# EasyEDA Pro project Radio Robotic GloveBox Manipulator.eprj

# Schematic Radio Robotic GloveBox Manipulator
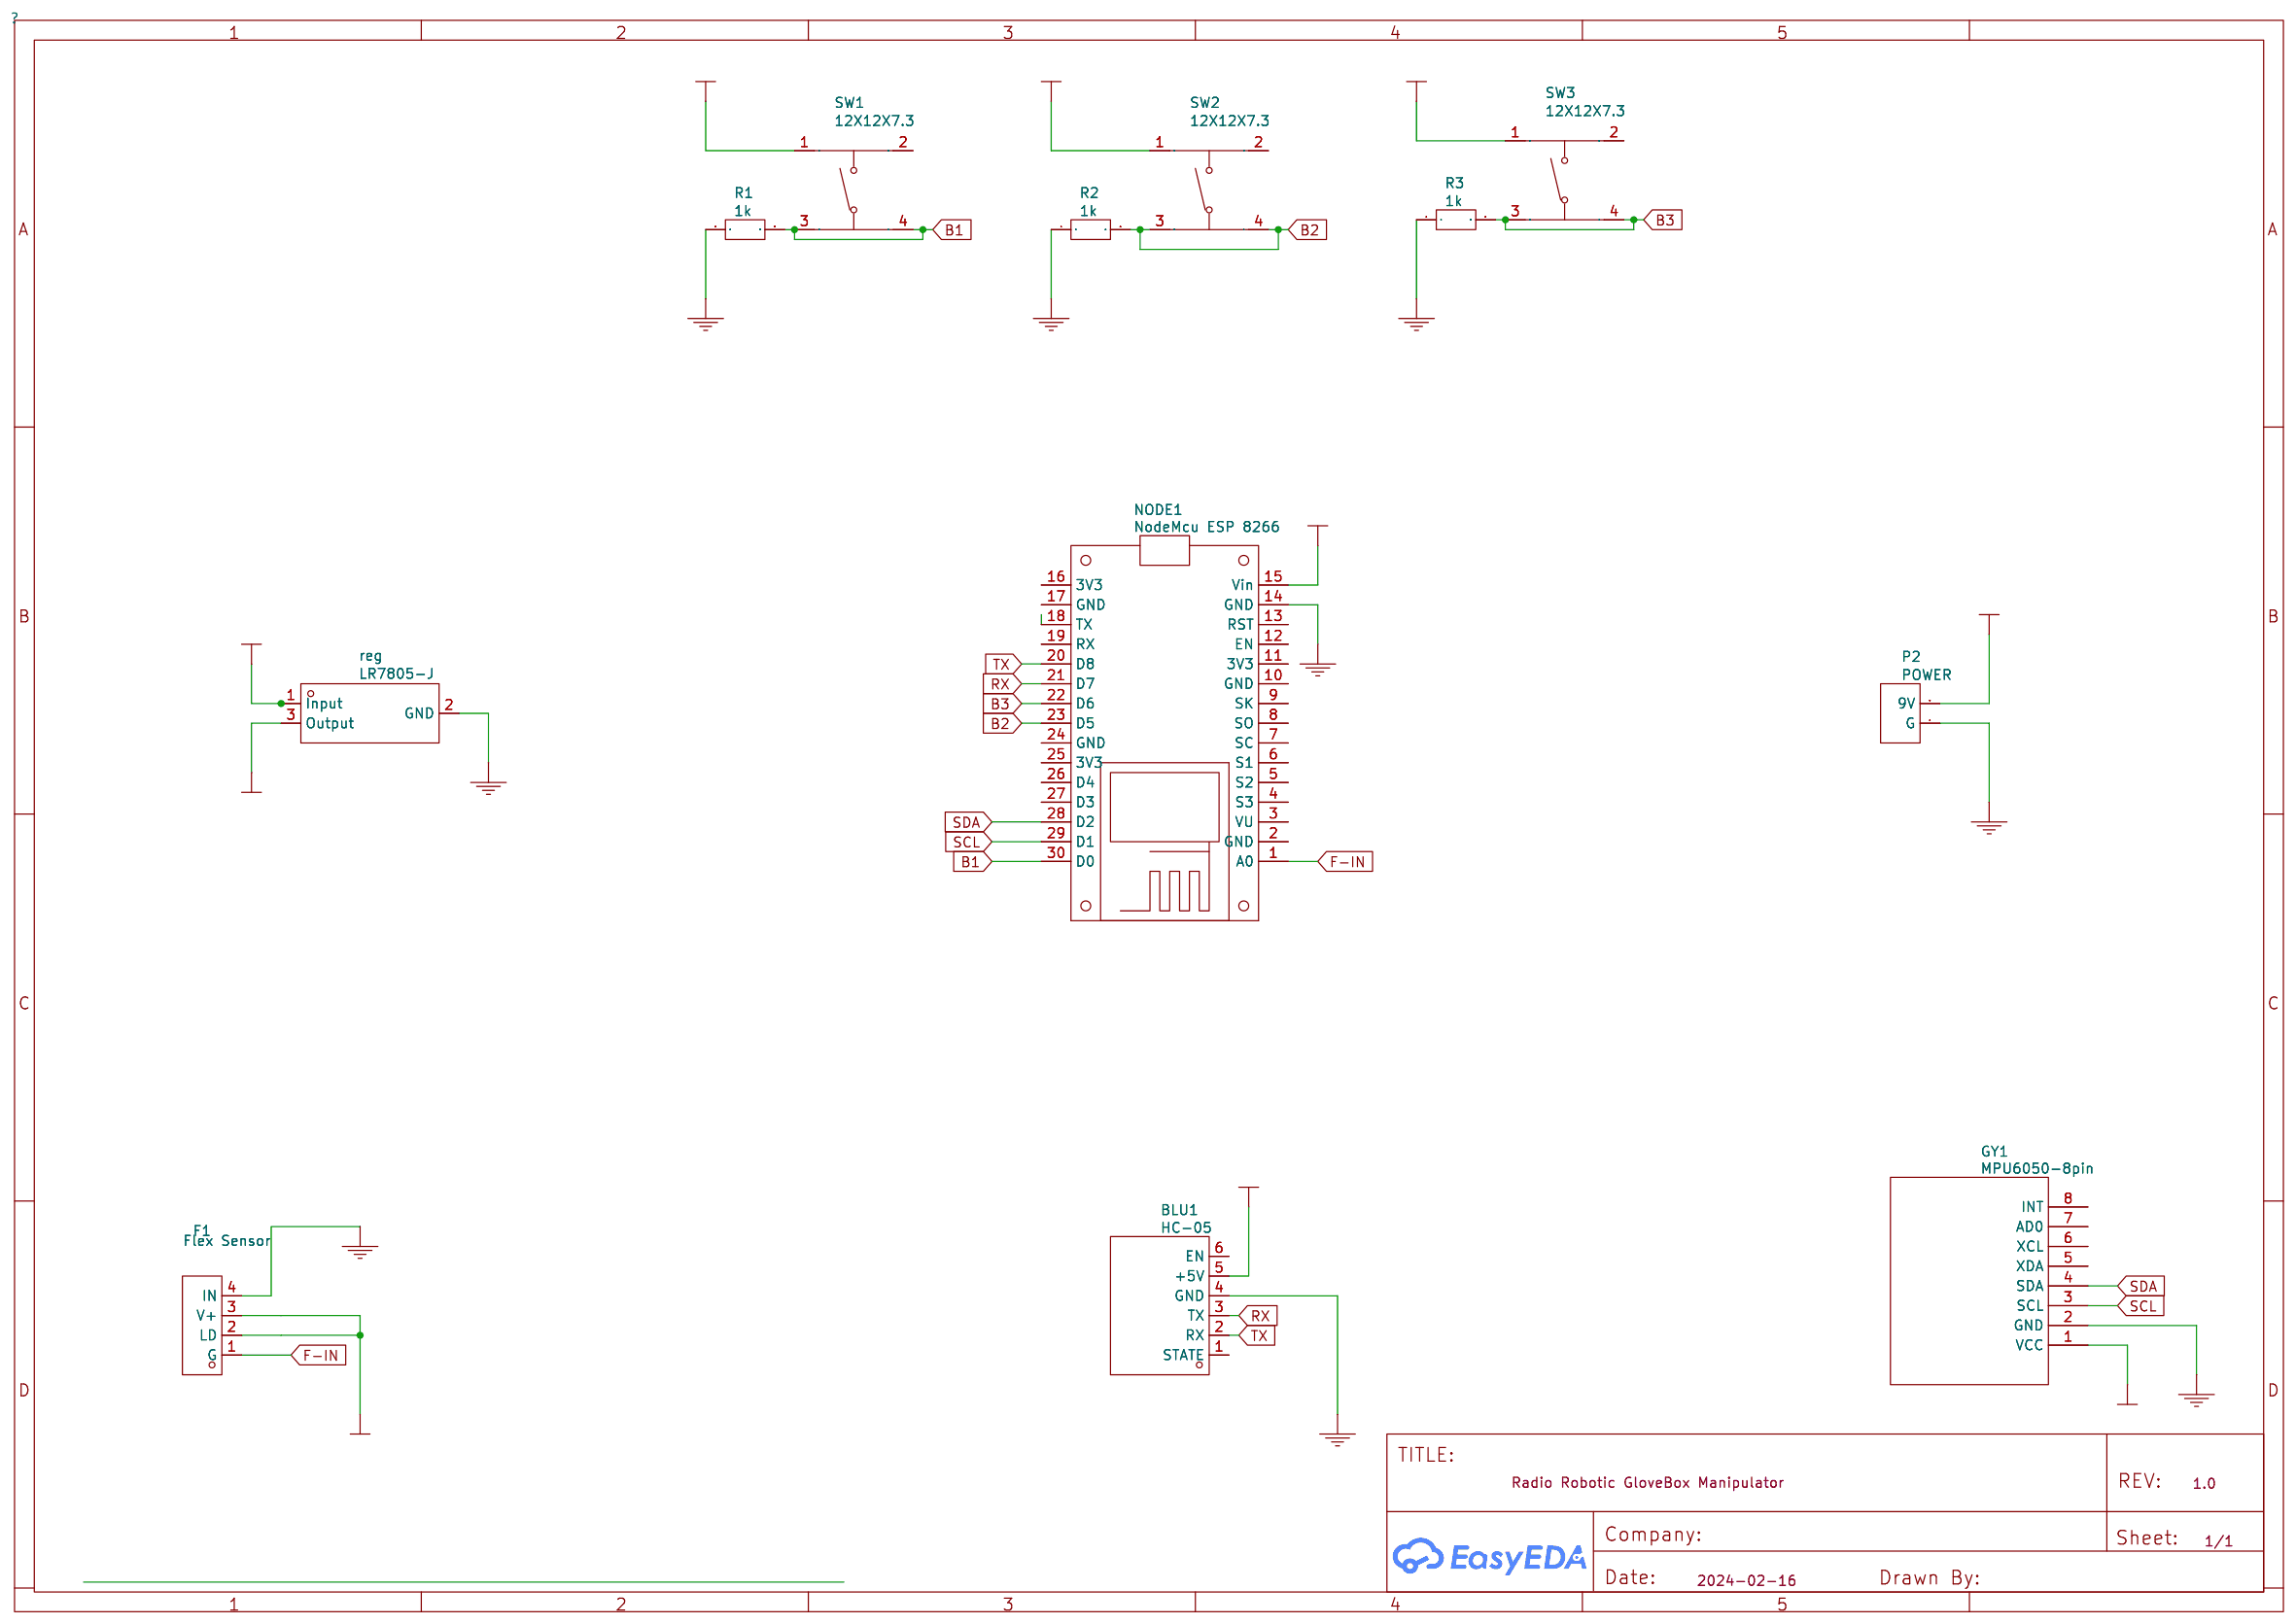
[diagram p0: schematic sheet]

## Parts
BLU1  HC-05  [HC-05]
F1  Flex Sensor  [CONN-TH_8P-P2.00_KINGHELM_KH-2FH-1X8P-H4.3]
GY1  MPU6050-8pin  [MPU6050-8PIN]
NODE1  NodeMcu ESP 8266  [NODEMCU-12E;NODEMCU-ESP8266]
P2  POWER  [CONN-TH_2P-P5.00]
R1  1k  [R_AXIAL-0.4]
R2  1k  [R_AXIAL-0.4]
R3  1k  [R_AXIAL-0.4]
reg  LR7805-J  [TO-220_L10.2-W4.6-P2.54_LR7805]
SW1  12X12X7.3  [SW-TH_4P-L12.0-W12.0-P5.00-LS12.5]
SW2  12X12X7.3  [SW-TH_4P-L12.0-W12.0-P5.00-LS12.5]
SW3  12X12X7.3  [SW-TH_4P-L12.0-W12.0-P5.00-LS12.5]

## Library data of the parts
BLU1 = HC-05
F1 = Flex Sensor: Supplier: LCSC; Supplier Part: C2938433; Manufacturer: kinghelm(金航标); Manufacturer Part: KH-2FH-1X8P-H4.3; JLCPCB Part Class: Extended Part
GY1 = MPU6050-8pin
NODE1 = NodeMcu ESP 8266: Supplier: TME
P2 = POWER: Supplier: LCSC
R1-R3 = 1k
reg = LR7805-J: Supplier: LCSC; Supplier Part: C6398168; Manufacturer: LR(朗瑞)
SW1-SW3 = 12X12X7.3: Supplier: LCSC; Supplier Part: C10861; Manufacturer: BOOMELE(博穆精密); Manufacturer Part: 12x12x7.3 黄头; JLCPCB Part Class: Extended Part

## Nets
+5V: BLU1.5(+5V) F1.2(LD) F1.3(V+) GY1.1(VCC) NODE1.15(Vin) reg.3(Output) SW1.1 SW2.1 SW3.1
GND: BLU1.4(GND) F1.4(IN) GY1.2(GND) NODE1.14(GND) P2.1(G) R1.1 R2.1 R3.1 reg.2(GND)
VCC: P2.2(9V) reg.1(Input)
B1: NODE1.30(D0) R1.2 SW1.3 SW1.4
B2: NODE1.23(D5) R2.2 SW2.3 SW2.4
B3: NODE1.22(D6) R3.2 SW3.3 SW3.4
F-IN: F1.1(G) NODE1.1(A0)
RX: BLU1.3(TX) NODE1.21(D7)
SCL: GY1.3(SCL) NODE1.29(D1)
SDA: GY1.4(SDA) NODE1.28(D2)
TX: BLU1.2(RX) NODE1.20(D8)

Not connected (* = marked no-connect by the designer): BLU1 1(STATE) 6(EN); GY1 5(XDA) 6(XCL) 7(AD0) 8(INT); NODE1 2(GND) 3(VU) 4(S3) 5(S2) 6(S1) 7(SC) 8(SO) 9(SK) 10(GND) 11(3V3) 12(EN) 13(RST) 16(3V3) 17(GND) 18(TX) 19(RX) 24(GND) 25(3V3) 26(D4) 27(D3); SW1 2; SW2 2; SW3 2

# Board MASTER
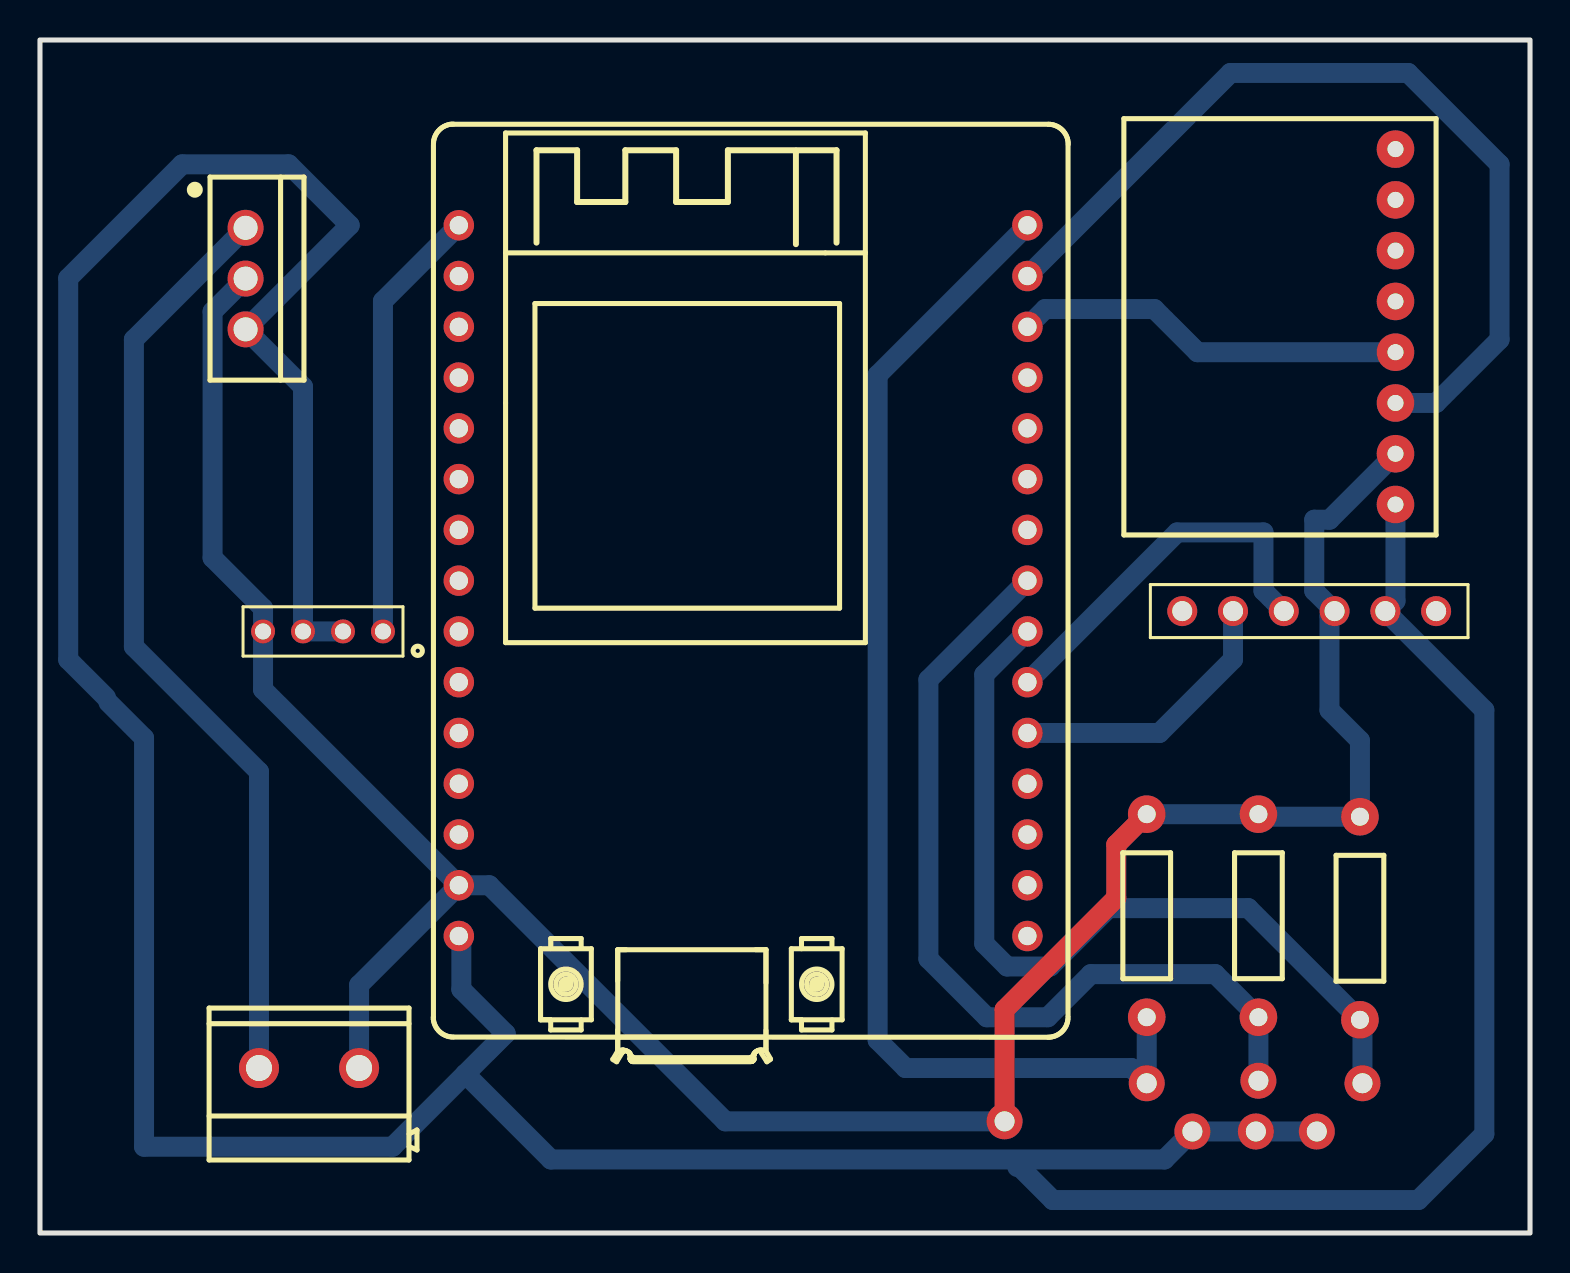
[diagram p1: board, top side]
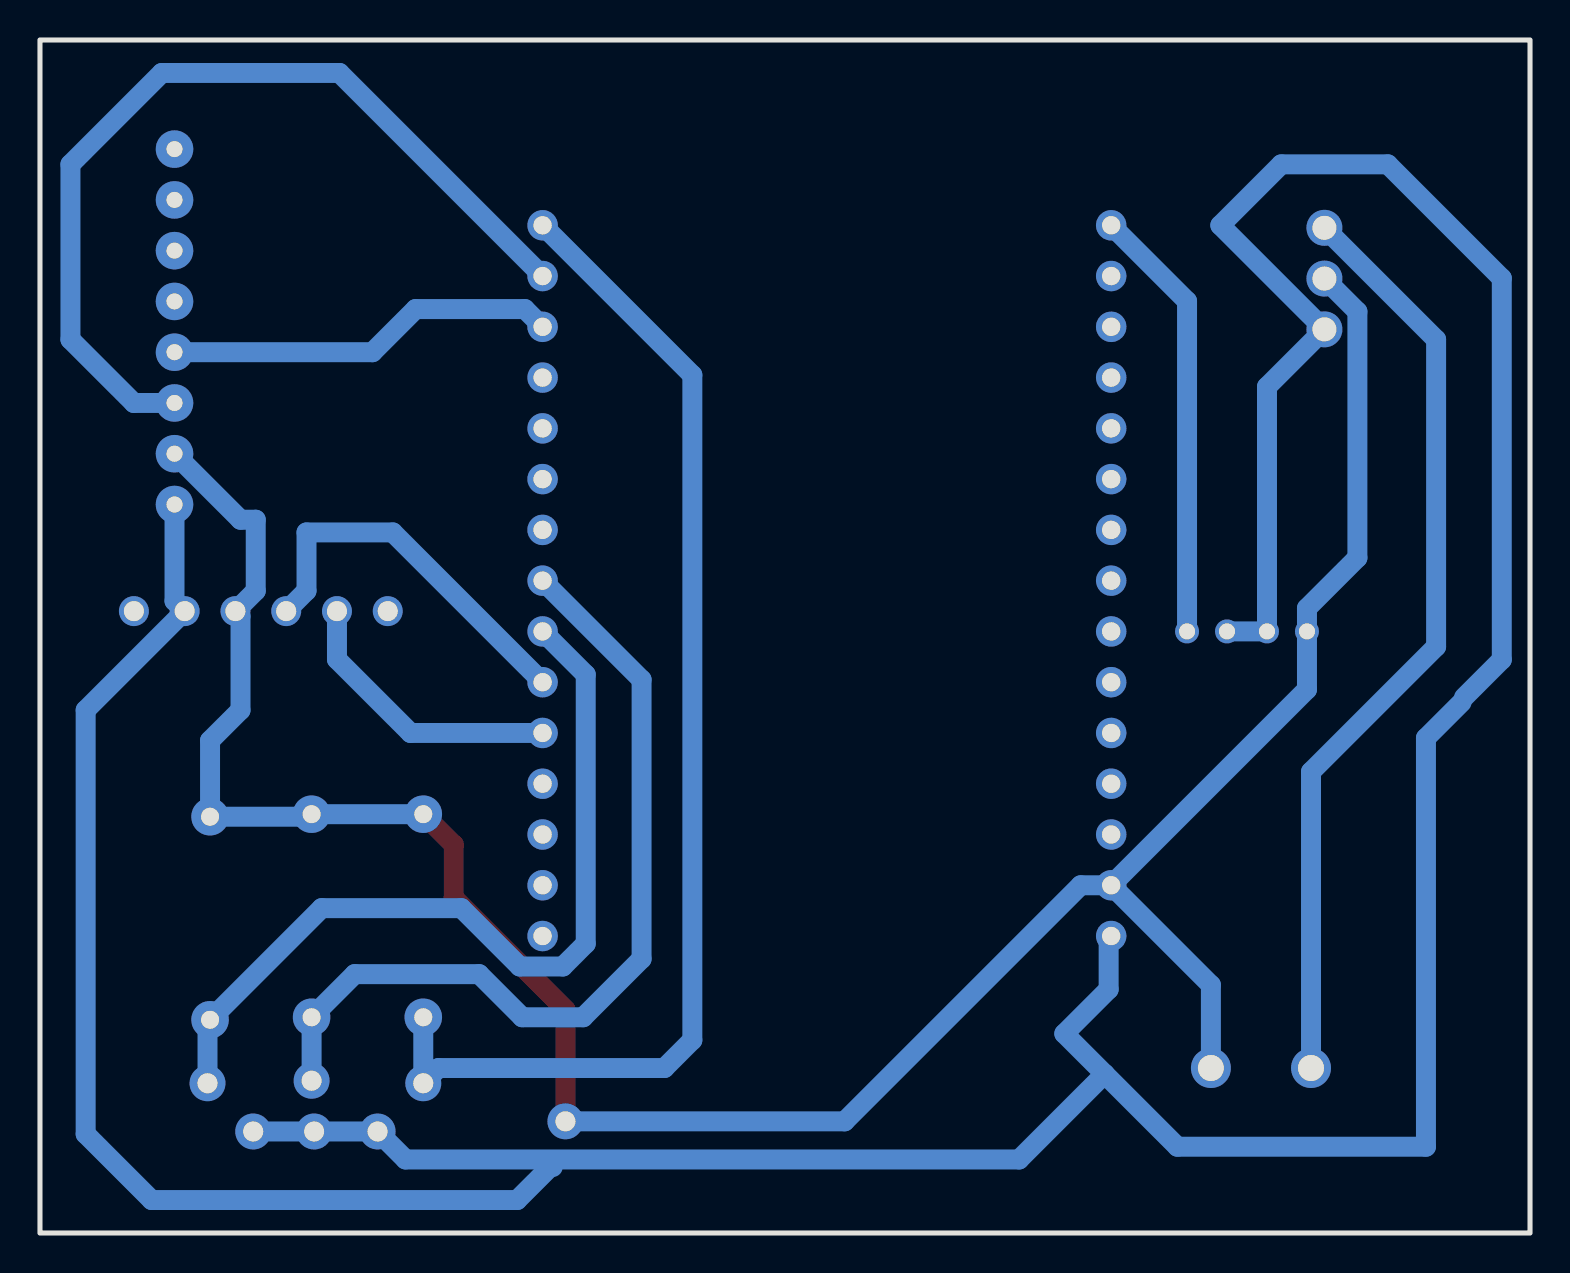
[diagram p2: board, bottom side, seen from below]

Outline 74.55 x 59.69 mm; copper layers: Top Layer, Bottom Layer. Coordinates in mm from the lower left corner of the outline.
Outline path: rectangle 0,59.69 74.55,0
Stack: Top Layer 0.035mm / Dielectric1 1.51mm FR4 er 4.5 / Bottom Layer 0.035mm

## Design rules (mm)
template: Custom Config
spacing copperThickness1oz (default): track to track 0.4, other pairs 0.152 to 0.5
spacing copperThickness2oz: track to track 0.203, other pairs 0.152 to 0.3
track width copperThickness1oz (default): min 0.8, default 1, max 2
track width copperThickness2oz: min 0.203, default 0.254, max 2.54
differential pair differentialPair (default): width min 0.127, default 0.254, max 2.54; gap min 0.152, default 0.152
via viaSize (default): diameter min 0.5, default 0.61, max 10; hole min 0.3, default 0.305, max 6.3

## Placement (name value [footprint] x y rotation side)
BLU1  -  [HC-05]  63.5 31.11 180 top
F1  Flex Sensor  [CONN-TH_8P-P2.00_KINGHELM_KH-2FH-1X8P-H4.3]  10.16 30.1 180 top
GY1  MPU6050-8pin  [MPU6050-8PIN]  69.85 34.92 90 top
NODE1  NodeMcu ESP 8266  [NODEMCU-12E;NODEMCU-ESP8266]  32.38 37.72 0 top
NOREF  -  [Pad_e7353]  48.26 5.59 0 top
NOREF#2  -  [Pad_e7187]  60.96 7.62 0 top
NOREF#3  -  [Pad_e7258]  57.66 5.08 0 top
NOREF#4  -  [Pad_e7260]  63.88 5.08 0 top
NOREF#5  -  [Pad_e7188]  66.17 7.49 0 top
NOREF#6  -  [Pad_e7259]  60.83 5.08 0 top
NOREF#7  -  [Pad_e7186]  55.37 7.49 0 top
P2  POWER  [CONN-TH_2P-P5.00]  13.46 8.25 180 top
R1  1k  [R_AXIAL-0.4]  55.37 15.88 270 top
R2  1k  [R_AXIAL-0.4]  60.96 15.88 270 top
R3  1k  [R_AXIAL-0.4]  66.04 15.75 270 top
reg  LR7805-J  [TO-220_L10.2-W4.6-P2.54_LR7805]  10.29 47.75 270 top

## Footprints (pads in the part's own frame, mm; a bottom-side part is the same pattern mirrored in y, then rotated)
CONN-TH_2P-P5.00
  round 2 hole 1.3: 1(-2.505,0) 2(2.505,0)
CONN-TH_8P-P2.00_KINGHELM_KH-2FH-1X8P-H4.3
  round 1.2 hole 0.8: 1(-7,0) 2(-5,0) 3(-3,0) 4(-1,0)
HC-05
  round 1.5 hole 1: 1(6.35,0) 2(3.81,0) 3(1.27,0) 4(-1.27,0) 5(-3.81,0) 6(-6.35,0)
MPU6050-8PIN
  round 1.879 hole 0.8: 1(1.524,2.032) 2(4.064,2.032) 3(6.604,2.032) 4(9.144,2.032) 5(11.684,2.032) 6(14.224,2.032) 7(16.764,2.032) 8(19.304,2.032)
NODEMCU-12E;NODEMCU-ESP8266
  round 1.524 hole 0.914: 1(-11.43,12.7) 2(-11.43,10.16) 3(-11.43,7.62) 4(-11.43,5.08) 5(-11.43,2.54) 6(-11.43,0) 7(-11.43,-2.54) 8(-11.43,-5.08) 9(-11.43,-7.62) 10(-11.43,-10.16) 11(-11.43,-12.7) 12(-11.43,-15.24) 13(-11.43,-17.78) 14(-11.43,-20.32) 15(-11.43,-22.86) 16(17.018,-22.86) 17(17.018,-20.32) 18(17.018,-17.78) 19(17.018,-15.24) 20(17.018,-12.7) 21(17.018,-10.16) 22(17.018,-7.62) 23(17.018,-5.08) 24(17.018,-2.54) 25(17.018,0) 26(17.018,2.54) 27(17.018,5.08) 28(17.018,7.62) 29(17.018,10.16) 30(17.018,12.7)
Pad_e7186
  round 1.8 hole 1: 1(0,0)
Pad_e7187
  round 1.8 hole 1: 2(0,0)
Pad_e7188
  round 1.8 hole 1: 3(0,0)
Pad_e7258
  round 1.8 hole 1: 4(0,0)
Pad_e7259
  round 1.8 hole 1: 31(0,0)
Pad_e7260
  round 1.8 hole 1: 32(0,0)
Pad_e7353
  round 1.8 hole 1: 33(0,0)
R_AXIAL-0.4
  round 1.879 hole 0.899: 1(-5.08,0) 2(5.08,0)
TO-220_L10.2-W4.6-P2.54_LR7805
  round 1.8 hole 1.2: 1(-2.54,0) 2(0,0) 3(2.54,0)

## Nets
+5V: BLU1.5 F1.2 F1.3 GY1.1 NODE1.15 NOREF#3.4 NOREF#4.32 NOREF#6.31 reg.3
GND: BLU1.4 F1.4 GY1.2 NODE1.14 NOREF.33 P2.1 R1.1 R2.1 R3.1 reg.2
VCC: P2.2 reg.1
B1: NODE1.30 NOREF#7.1 R1.2
B2: NODE1.23 NOREF#2.2 R2.2
B3: NODE1.22 NOREF#5.3 R3.2
F-IN: F1.1 NODE1.1
RX: BLU1.3 NODE1.21
SCL: GY1.3 NODE1.29
SDA: GY1.4 NODE1.28
TX: BLU1.2 NODE1.20
$1N33: NODE1.18

Pads without a net: BLU1 1 6; GY1 5 6 7 8; NODE1 2 3 4 5 6 7 8 9 10 11 12 13 16 17 19 24 25 26 27

## Routing (per net, layer and track width the routed paths; a pad name or vN(x,y) marks a point on that pad's centre or on a via; arc(x,y) is an arc through that point)
+5V: length 218.5
  Bottom Layer w1: 48.89,3.3 49.02,3.3 50.67,1.65 68.96,1.65 72.26,4.95 72.26,26.16 BLU1.5 67.82,31.62 GY1.1 ; F1.2 F1.3 13.16,42.34 reg.3 15.49,50.42 12.45,53.47 7.11,53.47 1.41,47.77 1.41,28.69 3.3,26.8 ; 21.28,7.96 25.56,3.68 56.26,3.68 NOREF#3.4 NOREF#6.31 NOREF#4.32 ; 21.28,7.96 23.3,9.98 21.08,12.19 21.08,14.73 NODE1.15 ; 21.28,7.96 17.64,4.32 5.21,4.32 5.21,24.77 3.43,26.54
GND: length 130
  Top Layer w1: R1.1 53.85,19.43 53.85,16.76 48.26,11.18 NOREF.33
  Bottom Layer w1: NODE1.14 22.48,17.4 34.29,5.59 NOREF.33 ; NODE1.14 11.16,27.19 F1.4 11.16,31.26 8.64,33.78 8.64,46.1 reg.2 ; NODE1.14 15.97,12.41 P2.1 ; GY1.2 64.52,35.69 63.75,35.69 63.75,32.13 BLU1.4 64.52,30.86 64.52,26.16 66.04,24.64 R3.1 61.09,20.83 R2.1 R1.1
VCC: length 46.9
  Bottom Layer w1: reg.1 4.7,44.7 4.7,29.34 10.96,23.08 P2.2
B1: length 61.5
  Bottom Layer w1: NODE1.30 41.91,42.93 41.91,9.65 43.31,8.25 54.61,8.25 NOREF#7.1 R1.2
B2: length 43.7
  Bottom Layer w1: NOREF#2.2 R2.2 58.8,12.95 52.58,12.95 50.42,10.8 47.37,10.8 44.45,13.72 44.45,27.69 NODE1.23
B3: length 42.8
  Bottom Layer w1: R3.2 60.45,16.26 53.47,16.26 50.55,13.33 48.39,13.33 47.24,14.48 47.24,27.94 NODE1.22 ; R3.2 66.17,10.54 ; R3.2 66.17,10.67 66.17,10.54 ; NOREF#5.3 66.17,10.54
F-IN: length 21.9
  Bottom Layer w1: NODE1.1 17.16,46.62 F1.1
RX: length 19.3
  Bottom Layer w1: BLU1.3 61.21,32.13 61.21,35.05 56.9,35.05 NODE1.21
SCL: length 45
  Bottom Layer w1: NODE1.29 59.56,58.04 68.45,58.04 73.03,53.47 73.03,44.7 69.85,41.53 GY1.3
SDA: length 19.7
  Bottom Layer w1: NODE1.28 50.29,46.23 55.75,46.23 57.91,44.07 GY1.4
TX: length 14.2
  Bottom Layer w1: NODE1.20 56.01,25.02 59.69,28.7 BLU1.2

# Board Slave
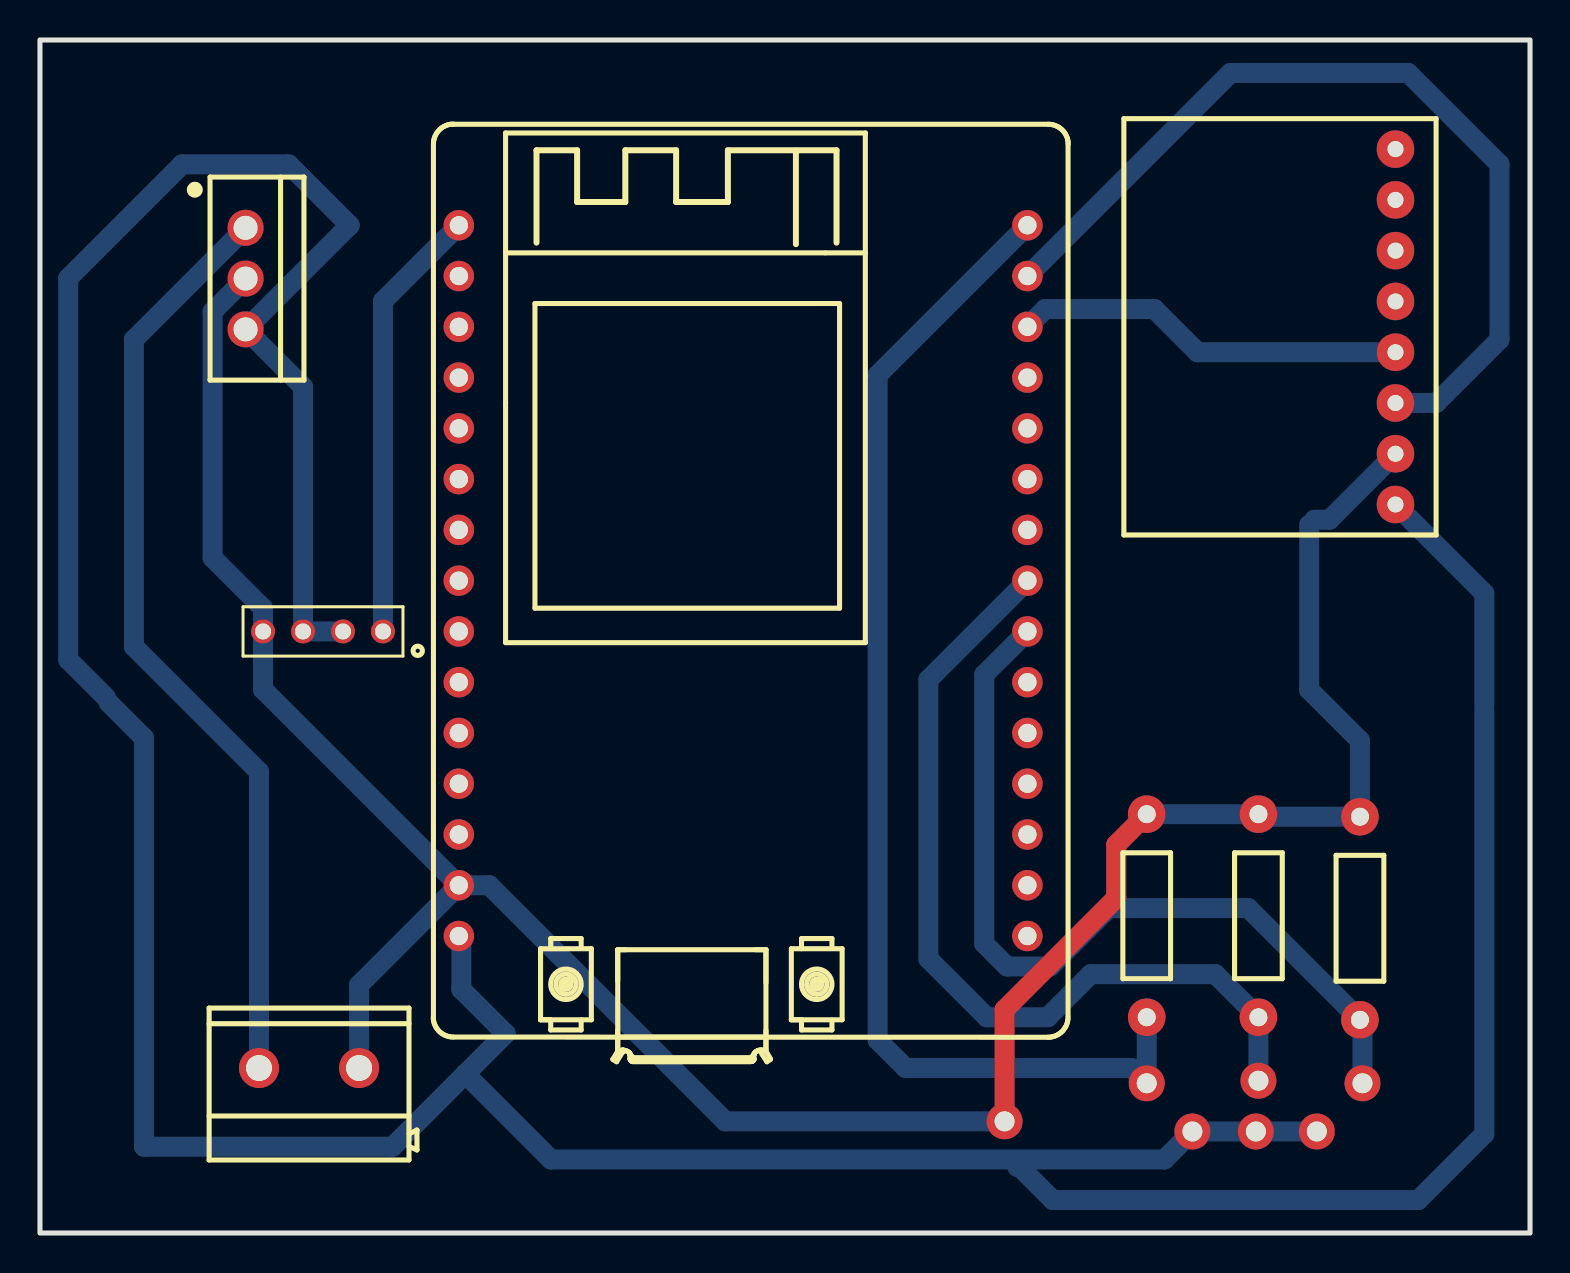
[diagram p3: board, top side]
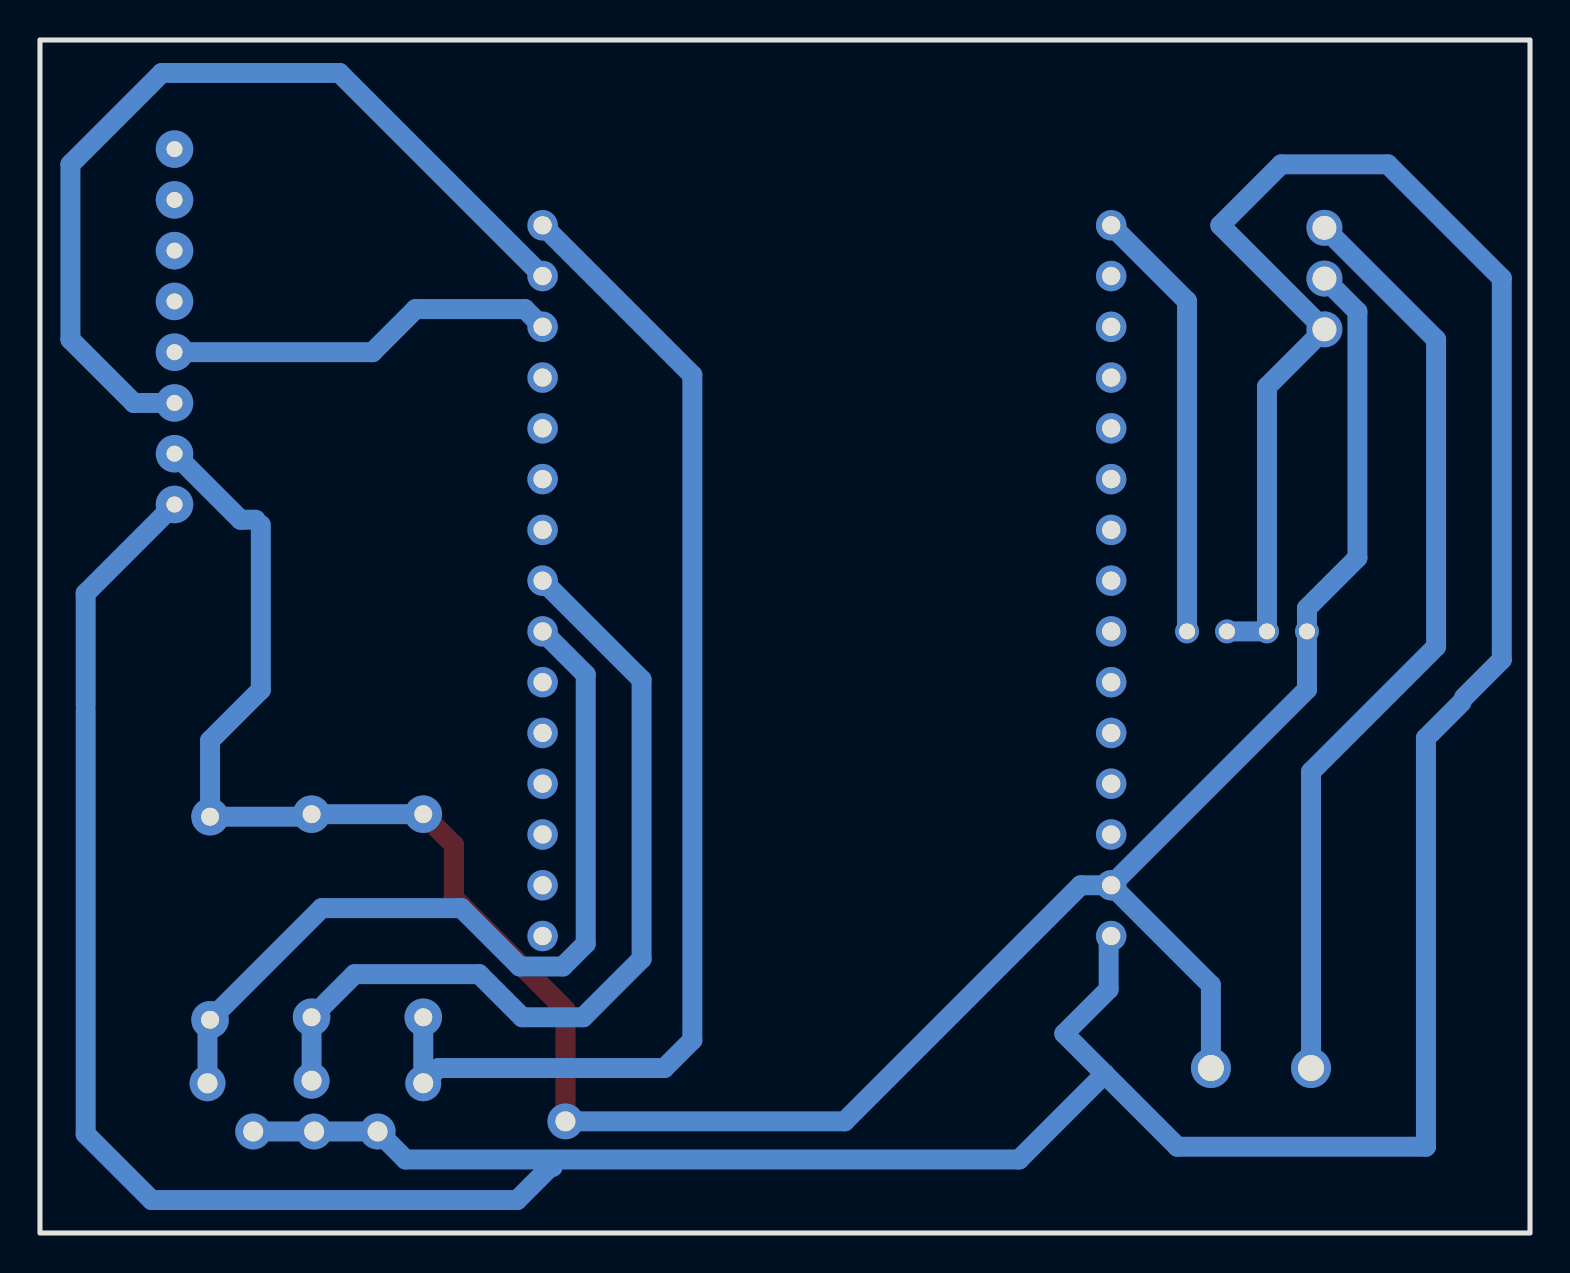
[diagram p4: board, bottom side, seen from below]

Outline 74.55 x 59.69 mm; copper layers: Top Layer, Bottom Layer. Coordinates in mm from the lower left corner of the outline.
Outline path: rectangle 0,59.69 74.55,0
Stack: Top Layer 0.035mm / Dielectric1 1.51mm FR4 er 4.5 / Bottom Layer 0.035mm

## Design rules (mm)
template: Custom Config
spacing copperThickness1oz (default): track to track 0.4, other pairs 0.152 to 0.5
spacing copperThickness2oz: track to track 0.203, other pairs 0.152 to 0.3
track width copperThickness1oz (default): min 0.8, default 1, max 2
track width copperThickness2oz: min 0.203, default 0.254, max 2.54
differential pair differentialPair (default): width min 0.127, default 0.254, max 2.54; gap min 0.152, default 0.152
via viaSize (default): diameter min 0.5, default 0.61, max 10; hole min 0.3, default 0.305, max 6.3

## Placement (name value [footprint] x y rotation side)
F1  Flex Sensor  [CONN-TH_8P-P2.00_KINGHELM_KH-2FH-1X8P-H4.3]  10.16 30.1 180 top
GY1  MPU6050-8pin  [MPU6050-8PIN]  69.85 34.92 90 top
NODE1  NodeMcu ESP 8266  [NODEMCU-12E;NODEMCU-ESP8266]  32.38 37.72 0 top
NOREF  -  [Pad_e97]  63.88 5.08 0 top
NOREF#2  -  [Pad_e11]  60.96 7.62 0 top
NOREF#3  -  [Pad_e99]  57.66 5.08 0 top
NOREF#4  -  [Pad_e8]  66.17 7.49 0 top
NOREF#5  -  [Pad_e102]  48.26 5.59 0 top
NOREF#6  -  [Pad_e14]  55.37 7.49 0 top
NOREF#7  -  [Pad_e98]  60.83 5.08 0 top
P2  POWER  [CONN-TH_2P-P5.00]  13.46 8.25 180 top
R1  1k  [R_AXIAL-0.4]  55.37 15.88 270 top
R2  1k  [R_AXIAL-0.4]  60.96 15.88 270 top
R3  1k  [R_AXIAL-0.4]  66.04 15.75 270 top
reg  LR7805-J  [TO-220_L10.2-W4.6-P2.54_LR7805]  10.29 47.75 270 top

## Footprints (pads in the part's own frame, mm; a bottom-side part is the same pattern mirrored in y, then rotated)
CONN-TH_2P-P5.00
  round 2 hole 1.3: 1(-2.505,0) 2(2.505,0)
CONN-TH_8P-P2.00_KINGHELM_KH-2FH-1X8P-H4.3
  round 1.2 hole 0.8: 1(-7,0) 2(-5,0) 3(-3,0) 4(-1,0)
MPU6050-8PIN
  round 1.879 hole 0.8: 1(1.524,2.032) 2(4.064,2.032) 3(6.604,2.032) 4(9.144,2.032) 5(11.684,2.032) 6(14.224,2.032) 7(16.764,2.032) 8(19.304,2.032)
NODEMCU-12E;NODEMCU-ESP8266
  round 1.524 hole 0.914: 1(-11.43,12.7) 2(-11.43,10.16) 3(-11.43,7.62) 4(-11.43,5.08) 5(-11.43,2.54) 6(-11.43,0) 7(-11.43,-2.54) 8(-11.43,-5.08) 9(-11.43,-7.62) 10(-11.43,-10.16) 11(-11.43,-12.7) 12(-11.43,-15.24) 13(-11.43,-17.78) 14(-11.43,-20.32) 15(-11.43,-22.86) 16(17.018,-22.86) 17(17.018,-20.32) 18(17.018,-17.78) 19(17.018,-15.24) 20(17.018,-12.7) 21(17.018,-10.16) 22(17.018,-7.62) 23(17.018,-5.08) 24(17.018,-2.54) 25(17.018,0) 26(17.018,2.54) 27(17.018,5.08) 28(17.018,7.62) 29(17.018,10.16) 30(17.018,12.7)
Pad_e8
  round 1.8 hole 1: 3(0,0)
Pad_e11
  round 1.8 hole 1: 2(0,0)
Pad_e14
  round 1.8 hole 1: 1(0,0)
Pad_e97
  round 1.8 hole 1: 32(0,0)
Pad_e98
  round 1.8 hole 1: 31(0,0)
Pad_e99
  round 1.8 hole 1: 4(0,0)
Pad_e102
  round 1.8 hole 1: 33(0,0)
R_AXIAL-0.4
  round 1.879 hole 0.899: 1(-5.08,0) 2(5.08,0)
TO-220_L10.2-W4.6-P2.54_LR7805
  round 1.8 hole 1.2: 1(-2.54,0) 2(0,0) 3(2.54,0)

## Nets
+5V: F1.2 F1.3 GY1.1 NODE1.15 NOREF.32 NOREF#3.4 NOREF#7.31 reg.3
GND: F1.4 GY1.2 NODE1.14 NOREF#5.33 P2.1 R1.1 R2.1 R3.1 reg.2
VCC: P2.2 reg.1
B1: NODE1.30 NOREF#6.1 R1.2
B2: NODE1.23 NOREF#2.2 R2.2
B3: NODE1.22 NOREF#4.3 R3.2
F-IN: F1.1 NODE1.1
RX: NODE1.21
SCL: GY1.3 NODE1.29
SDA: GY1.4 NODE1.28
TX: NODE1.20
$1N33: NODE1.18

Pads without a net: GY1 5 6 7 8; NODE1 2 3 4 5 6 7 8 9 10 11 12 13 16 17 19 24 25 26 27

## Routing (per net, layer and track width the routed paths; a pad name or vN(x,y) marks a point on that pad's centre or on a via; arc(x,y) is an arc through that point)
+5V: length 217.8
  Bottom Layer w1: 21.28,7.96 25.56,3.68 56.26,3.68 NOREF#3.4 NOREF#7.31 NOREF.32 ; 21.28,7.96 17.64,4.32 5.21,4.32 5.21,24.77 3.43,26.54 ; 21.28,7.96 23.3,9.98 21.08,12.19 21.08,14.73 20.96,14.86 ; 48.9,3.3 49.02,3.3 50.67,1.65 68.96,1.65 72.26,4.95 72.26,26.16 ; 3.3,26.8 1.41,28.69 1.41,47.77 7.11,53.47 12.45,53.47 15.49,50.42 reg.3 13.16,42.34 F1.3 F1.2 ; 72.26,26.42 72.26,32 GY1.1
GND: length 129.7
  Top Layer w1: R1.1 53.85,19.43 53.85,16.76 48.26,11.18 NOREF#5.33
  Bottom Layer w1: 67.82,38.99 64.52,35.69 63.75,35.69 ; 20.96,17.4 15.97,12.41 P2.1 ; 20.96,17.4 11.16,27.19 F1.4 11.16,31.26 8.64,33.78 8.64,46.1 reg.2 ; 20.96,17.4 22.48,17.4 34.29,5.59 NOREF#5.33 ; 63.5,35.43 63.5,27.18 66.04,24.64 R3.1 61.09,20.83 R2.1 R1.1
VCC: length 46.9
  Bottom Layer w1: reg.1 4.7,44.7 4.7,29.34 10.96,23.08 P2.2
B1: length 61.5
  Bottom Layer w1: R1.2 NOREF#6.1 54.61,8.25 43.31,8.25 41.91,9.65 41.91,42.93 NODE1.30
B2: length 43.7
  Bottom Layer w1: NOREF#2.2 R2.2 58.8,12.95 52.58,12.95 50.42,10.8 47.37,10.8 44.45,13.72 44.45,27.69 NODE1.23
B3: length 42.8
  Bottom Layer w1: R3.2 60.45,16.26 53.47,16.26 50.55,13.33 48.39,13.33 47.24,14.48 47.24,27.94 NODE1.22 ; R3.2 66.17,10.67 66.17,10.54 ; R3.2 66.17,10.54 ; NOREF#4.3 66.17,10.54
F-IN: length 21.9
  Bottom Layer w1: 20.96,50.42 17.16,46.62 F1.1
SCL: length 45
  Bottom Layer w1: NODE1.29 59.56,58.04 68.45,58.04 73.03,53.47 73.03,44.7 69.85,41.53 GY1.3
SDA: length 19.7
  Bottom Layer w1: NODE1.28 50.29,46.23 55.75,46.23 57.91,44.07 GY1.4
